# Altium schematic sheet PCIe ETHERNET.SchDoc: PCIe Ethernet
size 431 x 279 mm; CheckedBy: Lance Bantoto; Engineer: Chealsie Bains; DocumentNumber: 16; Revision: 1; SheetNumber: 16; SheetTotal: 23
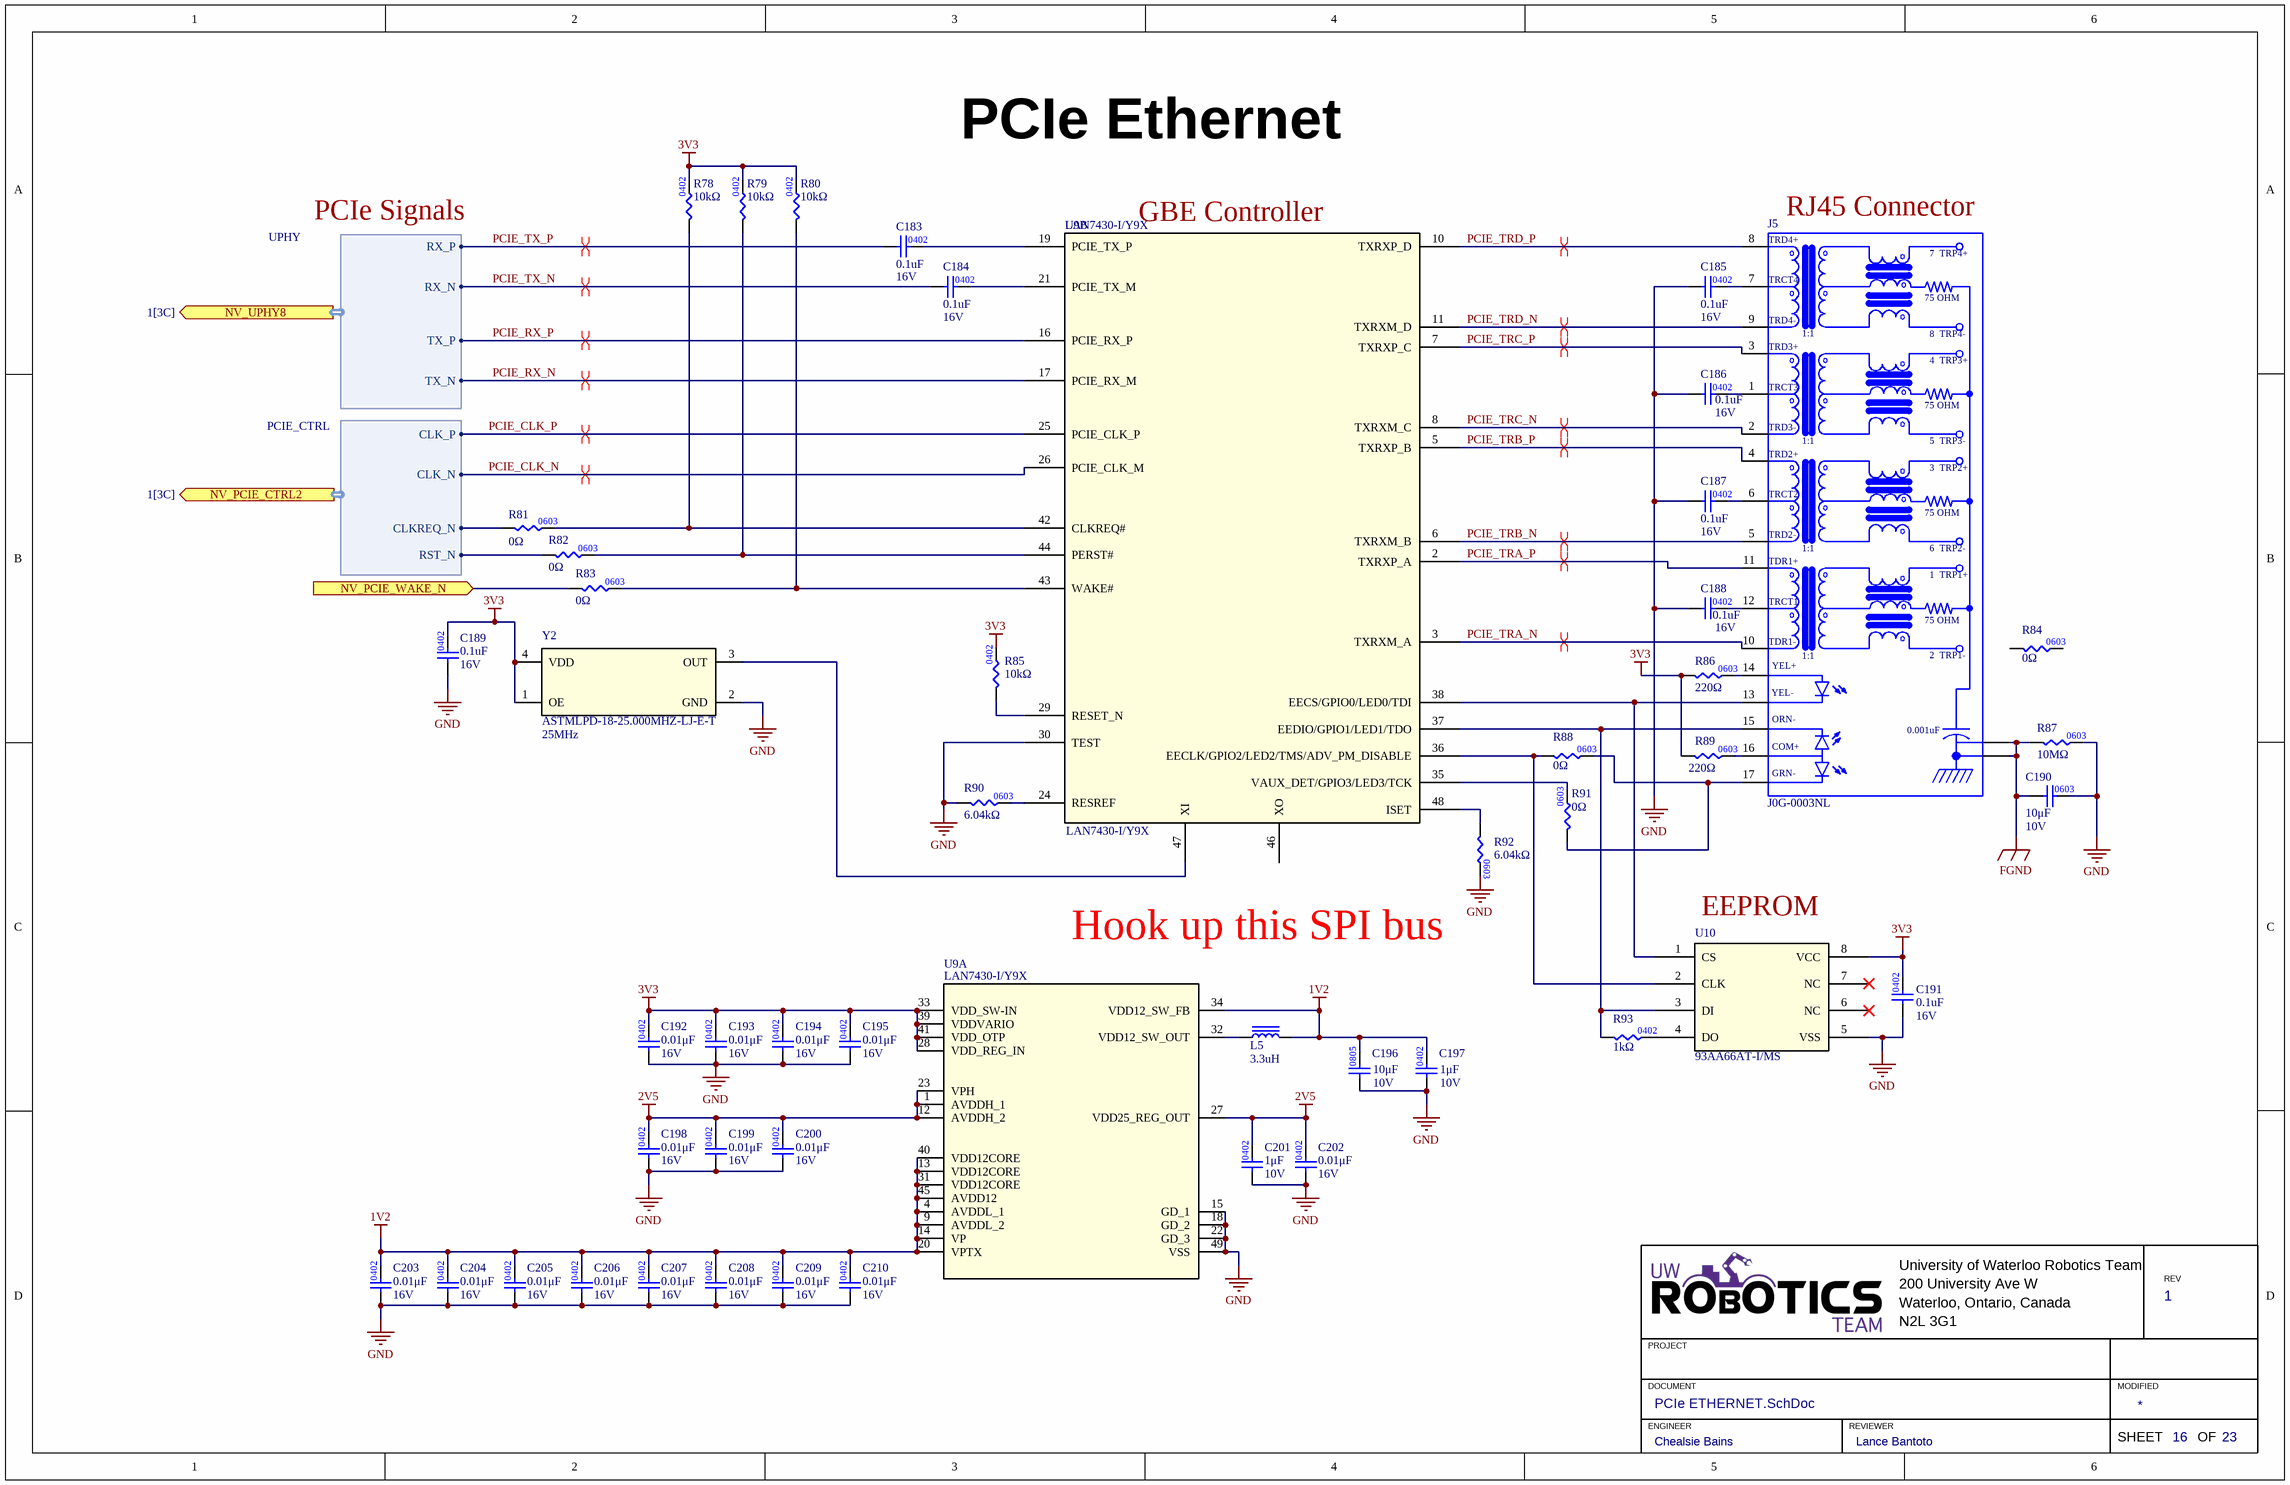
[diagram p0: PCIe ETHERNET.SchDoc]

## Parts
C183  Capacitance: 0.1uF  Voltage Rating: 16V  [CAP0402]  (hidden comment: CAP_0.1uF_16V_X7R_0402)
C184  Capacitance: 0.1uF  Voltage Rating: 16V  [CAP0402]  (hidden comment: CAP_0.1uF_16V_X7R_0402)
C185  Capacitance: 0.1uF  Voltage Rating: 16V  [CAP0402]  (hidden comment: CAP_0.1uF_16V_X7R_0402)
C186  Capacitance: 0.1uF  Voltage Rating: 16V  [CAP0402]  (hidden comment: CAP_0.1uF_16V_X7R_0402)
C187  Capacitance: 0.1uF  Voltage Rating: 16V  [CAP0402]  (hidden comment: CAP_0.1uF_16V_X7R_0402)
C188  Capacitance: 0.1uF  Voltage Rating: 16V  [CAP0402]  (hidden comment: CAP_0.1uF_16V_X7R_0402)
C189  Capacitance: 0.1uF  Voltage Rating: 16V  [CAP0402]  (hidden comment: CAP_0.1uF_16V_X7R_0402)
C190  value 10μF  Voltage Rating: 10V  [CAP0603]  (hidden comment: CAP_10uF_10V_0603)
C191  Capacitance: 0.1uF  Voltage Rating: 16V  [CAP0402]  (hidden comment: CAP_0.1uF_16V_X7R_0402)
C192  Capacitance: 0.01μF  Voltage Rating: 16V  [CAP0402]  (hidden comment: CAP_0.01uF_16V_X7R_0402)
C193  Capacitance: 0.01μF  Voltage Rating: 16V  [CAP0402]  (hidden comment: CAP_0.01uF_16V_X7R_0402)
C194  Capacitance: 0.01μF  Voltage Rating: 16V  [CAP0402]  (hidden comment: CAP_0.01uF_16V_X7R_0402)
C195  Capacitance: 0.01μF  Voltage Rating: 16V  [CAP0402]  (hidden comment: CAP_0.01uF_16V_X7R_0402)
C196  value 10μF  Voltage Rating: 10V  [CAP0805]  (hidden comment: CAP_10UF_10V_X6S_0805)
C197  Capacitance: 1μF  Rated DC Voltage (URdc): 10V  [CAP0402]  (hidden comment: CAP_1UF_10V_0402_X5R)
C198  Capacitance: 0.01μF  Voltage Rating: 16V  [CAP0402]  (hidden comment: CAP_0.01uF_16V_X7R_0402)
C199  Capacitance: 0.01μF  Voltage Rating: 16V  [CAP0402]  (hidden comment: CAP_0.01uF_16V_X7R_0402)
C200  Capacitance: 0.01μF  Voltage Rating: 16V  [CAP0402]  (hidden comment: CAP_0.01uF_16V_X7R_0402)
C201  Capacitance: 1μF  Rated DC Voltage (URdc): 10V  [CAP0402]  (hidden comment: CAP_1UF_10V_0402_X5R)
C202  Capacitance: 0.01μF  Voltage Rating: 16V  [CAP0402]  (hidden comment: CAP_0.01uF_16V_X7R_0402)
C203  Capacitance: 0.01μF  Voltage Rating: 16V  [CAP0402]  (hidden comment: CAP_0.01uF_16V_X7R_0402)
C204  Capacitance: 0.01μF  Voltage Rating: 16V  [CAP0402]  (hidden comment: CAP_0.01uF_16V_X7R_0402)
C205  Capacitance: 0.01μF  Voltage Rating: 16V  [CAP0402]  (hidden comment: CAP_0.01uF_16V_X7R_0402)
C206  Capacitance: 0.01μF  Voltage Rating: 16V  [CAP0402]  (hidden comment: CAP_0.01uF_16V_X7R_0402)
C207  Capacitance: 0.01μF  Voltage Rating: 16V  [CAP0402]  (hidden comment: CAP_0.01uF_16V_X7R_0402)
C208  Capacitance: 0.01μF  Voltage Rating: 16V  [CAP0402]  (hidden comment: CAP_0.01uF_16V_X7R_0402)
C209  Capacitance: 0.01μF  Voltage Rating: 16V  [CAP0402]  (hidden comment: CAP_0.01uF_16V_X7R_0402)
C210  Capacitance: 0.01μF  Voltage Rating: 16V  [CAP0402]  (hidden comment: CAP_0.01uF_16V_X7R_0402)
J5  J0G-0003NL  [PULSE_J0G-0003NL]
L5  Inductance: 3.3uH  [IND_BOURNS_SRN6045]  (hidden comment: IND_3.3uH)
R78  Resistance: 10kΩ  [RES0805]  (hidden comment: RES_10kΩ_0402)
R79  Resistance: 10kΩ  [RES0805]  (hidden comment: RES_10kΩ_0402)
R80  Resistance: 10kΩ  [RES0805]  (hidden comment: RES_10kΩ_0402)
R81  value 0Ω  [RES0603]  (hidden comment: RES_0Ω_0603)
R82  value 0Ω  [RES0603]  (hidden comment: RES_0Ω_0603)
R83  value 0Ω  [RES0603]  (hidden comment: RES_0Ω_0603)
R84  value 0Ω  [RES0603]  (hidden comment: RES_0Ω_0603)
R85  Resistance: 10kΩ  [RES0805]  (hidden comment: RES_10kΩ_0402)
R86  value 220Ω  [RES0603]  (hidden comment: RES_220Ω_0603)
R87  value 10MΩ  [RES0603]  (hidden comment: RES_10MΩ_0603)
R88  value 0Ω  [RES0603]  (hidden comment: RES_0Ω_0603)
R89  value 220Ω  [RES0603]  (hidden comment: RES_220Ω_0603)
R90  value 6.04kΩ  [RES0603]  (hidden comment: RES_6.04kΩ_0603_1%)
R91  value 0Ω  [RES0603]  (hidden comment: RES_0Ω_0603)
R92  value 6.04kΩ  [RES0603]  (hidden comment: RES_6.04kΩ_0603_1%)
R93  value 1kΩ  [RES0402]  (hidden comment: RES_1kΩ_0402_1%)
U9  LAN7430-I/Y9X  [LAN7430-I/Y9X-ND]  (parts A,B of 2)
U10  93AA66AT-I/MS  [SOP65P490X110-8N]
Y2  value 25MHz  [ASTMLPE_ABR]  (hidden comment: ASTMLPD-18-25.000MHZ-LJ-E-T)

## Ports
NV_PCIE_CTRL2 (out, harness PCIE_CTRL, see 1[3C]), NV_PCIE_WAKE_N (in), NV_UPHY8 (out, harness UPHY, see 1[3C])

## Harnesses
UPHY: RX_P, RX_N, TX_P, TX_N
PCIE_CTRL: CLK_P, CLK_N, CLKREQ_N, RST_N

## Nets
1V2: C196.2 C197.2 C203.2 C204.2 C205.2 C206.2 C207.2 C208.2 C209.2 C210.2 L5.2 U9.4(AVDDL_1) U9.9(AVDDL_2) U9.13(VDD12CORE) U9.14(VP) U9.20(VPTX) U9.31(VDD12CORE) U9.34(VDD12_SW_FB) U9.40(VDD12CORE) U9.45(AVDD12)
2V5: C198.2 C199.2 C200.2 C201.2 C202.2 U9.1(AVDDH_1) U9.12(AVDDH_2) U9.23(VPH) U9.27(VDD25_REG_OUT)
3V3: C189.2 C191.2 C192.2 C193.2 C194.2 C195.2 R78.2 R79.2 R80.2 R85.2 R86.1 R89.1 U9.28(VDD_REG_IN) U9.33(VDD_SW-IN) U9.39(VDDVARIO) U9.41(VDD_OTP) U10.8(VCC) Y2.1(OE) Y2.4(VDD)
FGND: C190.1 J5.SH1(SHIELD) J5.SH2(SHIELD) R87.1
GND: C185.1 C186.1 C187.1 C188.1 C189.1 C190.2 C191.1 C192.1 C193.1 C194.1 C195.1 C196.1 C197.1 C198.1 C199.1 C200.1 C201.1 C202.1 C203.1 C204.1 C205.1 C206.1 C207.1 C208.1 C209.1 C210.1 R87.2 R90.1 R92.2 U9.15(GD_1) U9.18(GD_2) U9.22(GD_3) U9.30(TEST) U9.49(VSS) U10.5(VSS) Y2.2(GND)
NV_PCIE_WAKE_N: R83.1 ; port NV_PCIE_WAKE_N
PCIE_CLK_N: U9.26(PCIE_CLK_M) ; port NV_PCIE_CTRL2.CLK_N
PCIE_CLK_P: U9.25(PCIE_CLK_P) ; port NV_PCIE_CTRL2.CLK_P
PCIE_RX_N: U9.17(PCIE_RX_M) ; port NV_UPHY8.TX_N
PCIE_RX_P: U9.16(PCIE_RX_P) ; port NV_UPHY8.TX_P
PCIE_TRA_N: J5.10(TDR1-) U9.3(TXRXM_A)
PCIE_TRA_P: J5.11(TDR1+) U9.2(TXRXP_A)
PCIE_TRB_N: J5.5(TRD2-) U9.6(TXRXM_B)
PCIE_TRB_P: J5.4(TRD2+) U9.5(TXRXP_B)
PCIE_TRC_N: J5.2(TRD3-) U9.8(TXRXM_C)
PCIE_TRC_P: J5.3(TRD3+) U9.7(TXRXP_C)
PCIE_TRD_N: J5.9(TRD4-) U9.11(TXRXM_D)
PCIE_TRD_P: J5.8(TRD4+) U9.10(TXRXP_D)
PCIE_TX_N: C184.1 ; port NV_UPHY8.RX_N
PCIE_TX_P: C183.1 ; port NV_UPHY8.RX_P
NetC183_2: C183.2 U9.19(PCIE_TX_P)
NetC184_2: C184.2 U9.21(PCIE_TX_M)
NetC185_2: C185.2 J5.7(TRCT4)
NetC186_2: C186.2 J5.1(TRCT3)
NetC187_2: C187.2 J5.6(TRCT2)
NetC188_2: C188.2 J5.12(TRCT1)
NetJ5_13: J5.13(YEL-) U9.38(EECS/GPIO0/LED0/TDI) U10.1(CS)
NetJ5_14: J5.14(YEL+) R86.2
NetJ5_15: J5.15(ORN-) R93.1 U9.37(EEDIO/GPIO1/LED1/TDO) U10.3(DI)
NetJ5_16: J5.16(COM+) R89.2
NetJ5_17: J5.17(GRN-) R88.2 R91.1
NetL5_1: L5.1 U9.32(VDD12_SW_OUT)
NetR78_1: R78.1 R81.2 U9.42(CLKREQ#)
NetR79_1: R79.1 R82.2 U9.44(PERST#)
NetR80_1: R80.1 R83.2 U9.43(WAKE#)
NetR81_1: R81.1 ; port NV_PCIE_CTRL2.CLKREQ_N
NetR82_1: R82.1 ; port NV_PCIE_CTRL2.RST_N
NetR85_1: R85.1 U9.29(RESET_N)
NetR88_1: R88.1 U9.36(EECLK/GPIO2/LED2/TMS/ADV_PM_DISABLE) U10.2(CLK)
NetR90_2: R90.2 U9.24(RESREF)
NetR91_2: R91.2 U9.35(VAUX_DET/GPIO3/LED3/TCK)
NetR92_1: R92.1 U9.48(ISET)
NetR93_2: R93.2 U10.4(DO)
NetU9_47: U9.47(XI) Y2.3(OUT)

Not connected (* = marked no-connect by the designer): R84 1 2; U9 46(XO); U10 6(NC)* 7(NC)*

## Layout directives
differential pair: PCIE_CLK_N, PCIE_CLK_P, PCIE_RX_N, PCIE_RX_P, PCIE_TRA_N, PCIE_TRA_P, PCIE_TRB_N, PCIE_TRB_P, PCIE_TRC_N, PCIE_TRC_P, PCIE_TRD_N, PCIE_TRD_P, PCIE_TX_N, PCIE_TX_P

## Notes on the sheet
- PCIe Signals
- (near U9) GBE Controller
- (near J5) RJ45 Connector
- Hook up this SPI bus
- (near U10) EEPROM
- University of Waterloo Robotics Team
- 200 University Ave W
- REV
- PROJECT
- Waterloo, Ontario, Canada
- N2L 3G1
- DOCUMENT
- ENGINEER
- REVIEWER
- MODIFIED
- SHEET
- OF
- (in symbol CAP_0.01uF_16V_X7R_0402) 0402
- (in symbol CAP_10uF_10V_0603) 0603
- (in symbol J0G-0003NL) 7  TRP4+; 75 OHM; 1:1; 8  TRP4-; 4  TRP3+; 5  TRP3-; 3  TRP2+; 6  TRP2-; 1  TRP1+; 2  TRP1-; 0.001uF
- (in symbol RES_10MΩ_0603_5%) 0603

## Library data of the parts
C183-C189 C191 = CAP_0.1uF_16V_X7R_0402: CAP CER 0.1UF 16V X7R 0402; Supplier 1: Digi-Key; Mounting Type: Surface Mount; Package: 0402
C190 = CAP_10uF_10V_0603: CAP CER 10UF 10V X5R 0603; Manufacturer Part Number 1: CC0603MRX5R6BB106; Manufacturer 1: Yageo; Supplier Part Number 1: 311-1817-1-ND; Supplier 1: Digi-Key; Dielectric: X5R
C192-C195 C198-C200 C202-C210 = CAP_0.01uF_16V_X7R_0402: CAP CER 0.01uF 16V X7R 0402; Manufacturer: KEMET; Manufacturer Part Number: C0402C103J4RACTU; Supplier 1: Digi-Key; Supplier Part Number 1: 399-1039-1-ND; Mounting Type: Surface Mount
C196 = CAP_10UF_10V_X6S_0805: CAP CER 10UF 10V X6S 0805; Manufacturer 1: Taiyo Yuden; Manufacturer Part Number 1: LMK212AC6106MD-T; Supplier 1: Digi-Key; Supplier Part Number 1: 587-6337-1-ND; Package: 0805
C197 C201 = CAP_1UF_10V_0402_X5R: CAP CER 1UF 10V X5R 0402; Manufacturer: Kyocera AVX; Manufacturer Part Number: 0402ZD105MAT2A; Supplier 1: Digi-Key; Supplier Part Number 1: 478-5768-1-ND; Temperature Characteristics Code: X5R; ComponentLink7URL: https://datasheet.ciiva.com/11531/cx5r-11531784.pdf?src-supplier=Avnet; ComponentLink7Description: https://datasheet.ciiva.com/11531/cx5r-11531784.pdf?src-supplier=Avnet; Mounting Type: Surface Mount; Package: 0402
J5 = J0G-0003NL: 1 Port RJ45 Magjack Connector Through Hole 10/100/1000 Base-T, AutoMDIX; MF: Pulse Electronics; Digi-Key_Part_Number: 553-1852-ND; Package: Custom Package Pulse Electronics Network; MP: J0G-0003NL; SnapEDA_Link: https://www.snapeda.com/parts/J0G-0003NL/Pulse%20Electronics%20Network/view-part/368728/?ref=snap; Digi-Key_Purchase_URL: https://www.digikey.com/product-detail/en/pulse-electronics-network/J0G-0003NL/553-1852-ND/2264761?utm_source=snapeda&utm_medium=aggregator&utm_campaign=symbol; Value: *
L5 = IND_3.3uH: FIXED INDUCTOR 3.3UH SMD; Manufacturer 1: KEMET; Manufacturer Part Number 1: L0603B3R3MDWFT; Test Frequency: 100kHz; DC Current: 1.9A; Inductance Tolerance: 20%; Shielding: Shielded; Saturation Current: 2.3A; Self Resonant Frequency: 13MHz; Supplier 1: Digi-Key; Number of Pins: 2; Composition: Wirewound; Military Standard: Not; RMS Current (Irms): 1.9A; Current Rating: 1.9A; ComponentLink7URL: https://datasheet.ciiva.com/4954/srn6045-70649-4954231.pdf?src-supplier=Mouser; ComponentLink7Description: https://datasheet.ciiva.com/4954/srn6045-70649-4954231.pdf?src-supplier=Mouser; ComponentLink8URL: https://datasheet.ciiva.com/1056/srn6045-1056106.pdf?src-supplier=Digi-Key; ComponentLink8Description: https://datasheet.ciiva.com/1056/srn6045-1056106.pdf?src-supplier=Digi-Key; ComponentLink9URL: https://datasheet.ciiva.com/1056/srn6045-1056108.pdf?src-supplier=Digi-Key; ComponentLink9Description: https://datasheet.ciiva.com/1056/srn6045-1056108.pdf?src-supplier=Digi-Key; Supplier Part Number 1: SRN6045-150MCT-ND
R78-R80 R85 = RES_10kΩ_0402: Fixed Resistor, Thin Film, 0.1W, 10000ohm, 50V, 0.1% +/-Tol, 25ppm/Cel, Surface Mount, 0402; Manufacturer 1: Panasonic; Manufacturer Part Number 1: ERJ-PB6B6043V; Manufacturer: Stackpole Electronics; Manufacturer Part Number: RNCF0402BTE10K0; Additional Feature: PRECISION; Rated Power Dissipation (P): 63mW; Rated Temperature: 70°C; Temperature Coefficient: 25ppm/°C; Working Voltage: 25V; Package Height: 0.3mm; Package Length: 1mm; Package Width: 0.5mm; Reference Standard: AEC-Q200; Supplier 1: Digi-Key; Supplier Part Number 1: P20911CT-ND; Supplier 2: Digi-Key; Supplier Part Number 2: RNCF0402BTE10K0CT-ND; RoHS: Yes; Category: Chip SMD Resistors; Stock 2: 76384; Pricing 2: 1=0.36000, 10=0.25900, 100=0.10350, 1000=0.05100, 2500=0.04725, 5000=0.04275 (USD); Mount: Surface Mount; Number of Pins: 2; Package Shape: Rectangular; Terminal Finish: Nickel; Min Operating Temperature: -55°C; Max Operating Temperature: 155°C; Tolerance: 0.1%; JESD-609 Code: e3; Resistor Type: FIXED RESISTOR; Construction: Rectangular; Package Style: SMTMeter; Packaging: Tape and Reel; Technology: THIN FILM; Termination: Wraparound; REACH SVHC: Yes; RoHS Compliant: Yes; ComponentLink1URL: https://datasheet.ciiva.com:443/pdfs/VipMasterIC/IC/SEIE/SEIE-S-A0009648208/SEIE-S-A0009648208-1.pdf?src-supplier=IHS+Markit; ComponentLink1Description: https://datasheet.ciiva.com:443/pdfs/VipMasterIC/IC/SEIE/SEIE-S-A0009648208/SEIE-S-A0009648208-1.pdf?src-supplier=IHS+Markit; ComponentLink2URL: https://www.seielect.com/catalog/SEI-Packaging.pdf?src-supplier=Digi-Key; ComponentLink2Description: https://www.seielect.com/catalog/SEI-Packaging.pdf?src-supplier=Digi-Key; ComponentLink3URL: https://www.seielect.com/Catalog/SEI-rncf.pdf?src-supplier=Avnet; ComponentLink3Description: https://www.seielect.com/Catalog/SEI-rncf.pdf?src-supplier=Avnet; Size Code: 0402
R81-R84 R88 R91 = RES_0Ω_0603: RES 0 OHM JUMPER 1/10W 0603; Manufacturer 1: Yageo; Manufacturer Part Number 1: RC0603JR-070RL; Supplier Part Number 1: 311-0.0GRCT-ND; Supplier 1: Digi-Key; Mounting Type: SMD; Package: 0603
R86 R89 = RES_220Ω_0603_5%: RES 220 OHM 5% 1/10W 0603; Manufacturer 1: Yageo; Manufacturer Part Number 1: AC0603JR-07220RL; Package/Footprint: 0603; Supplier Part Number 1: YAG3652CT-ND; Supplier 1: Digi-Key
R87 = RES_10MΩ_0603_5%: RES 10M OHM 5% 1/10W 0603; Manufacturer 1: Vishay Dale; Manufacturer Part Number 1: CRCW060310M0JNEA; Supplier Part Number 1: 541-10MGCT-ND; Supplier 1: Digi-Key
R90 R92 = RES_6.04kΩ_0603_1%: RES 6.04K OHM 1% 1/10W 0603; Manufacturer 1: Panasonic Electronic Components; Manufacturer Part Number 1: ERJ-PB3D6041V; Package/Footprint: 0603; Mounting Type: SMD; Supplier 1: Digi-Key; Supplier Part Number 1: P20372CT-ND
R93 = RES_1kΩ_0402_1%: RES 1K OHM 1% 1/16W 0402; Manufacturer 1: Stackpole Electronics; Manufacturer Part Number 1: RMCF0402FT1K00; Supplier 1: Digi-Key; Supplier Part Number 1: RMCF0402FT1K00CT-ND; Tolerance: 1%; Package: 0402
U9 = LAN7430-I/Y9X: IC ETHERNET CNTRLR GPIO 48SQFN; Manufacturer 1: Microchip Technology; Supplier 1: Digi-Key; Supplier Part Number 1: LAN7430-I/Y9X-ND; Manufacturer Part Number 1: LAN7430-I/Y9X
U10 = 93AA66AT-I/MS: IC EEPROM 4KBIT SPI 2MHZ 8MSOP; Manufacturer 1: Microchip Technology; Supplier 1: Digi-Key; Supplier Part Number 1: 93AA66AT-I/MS-ND; Manufacturer Part Number 1: 93AA66AT-I/MS
Y2 = ASTMLPD-18-25.000MHZ-LJ-E-T: MEMS OSC XO 25.0000MHZ LVCMOS; Manufacturer 1: Abracon; Supplier 1: Digi-Key; Supplier Part Number 1: 535-13096-1-ND; Manufacturer Part Number 1: ASTMLPD-18-25.000MHZ-LJ-E-T